# Altium schematic sheet 14-multimodal-microcontroller-switches-display.SchDoc
size A; SheetNumber: 7; SheetTotal: 10
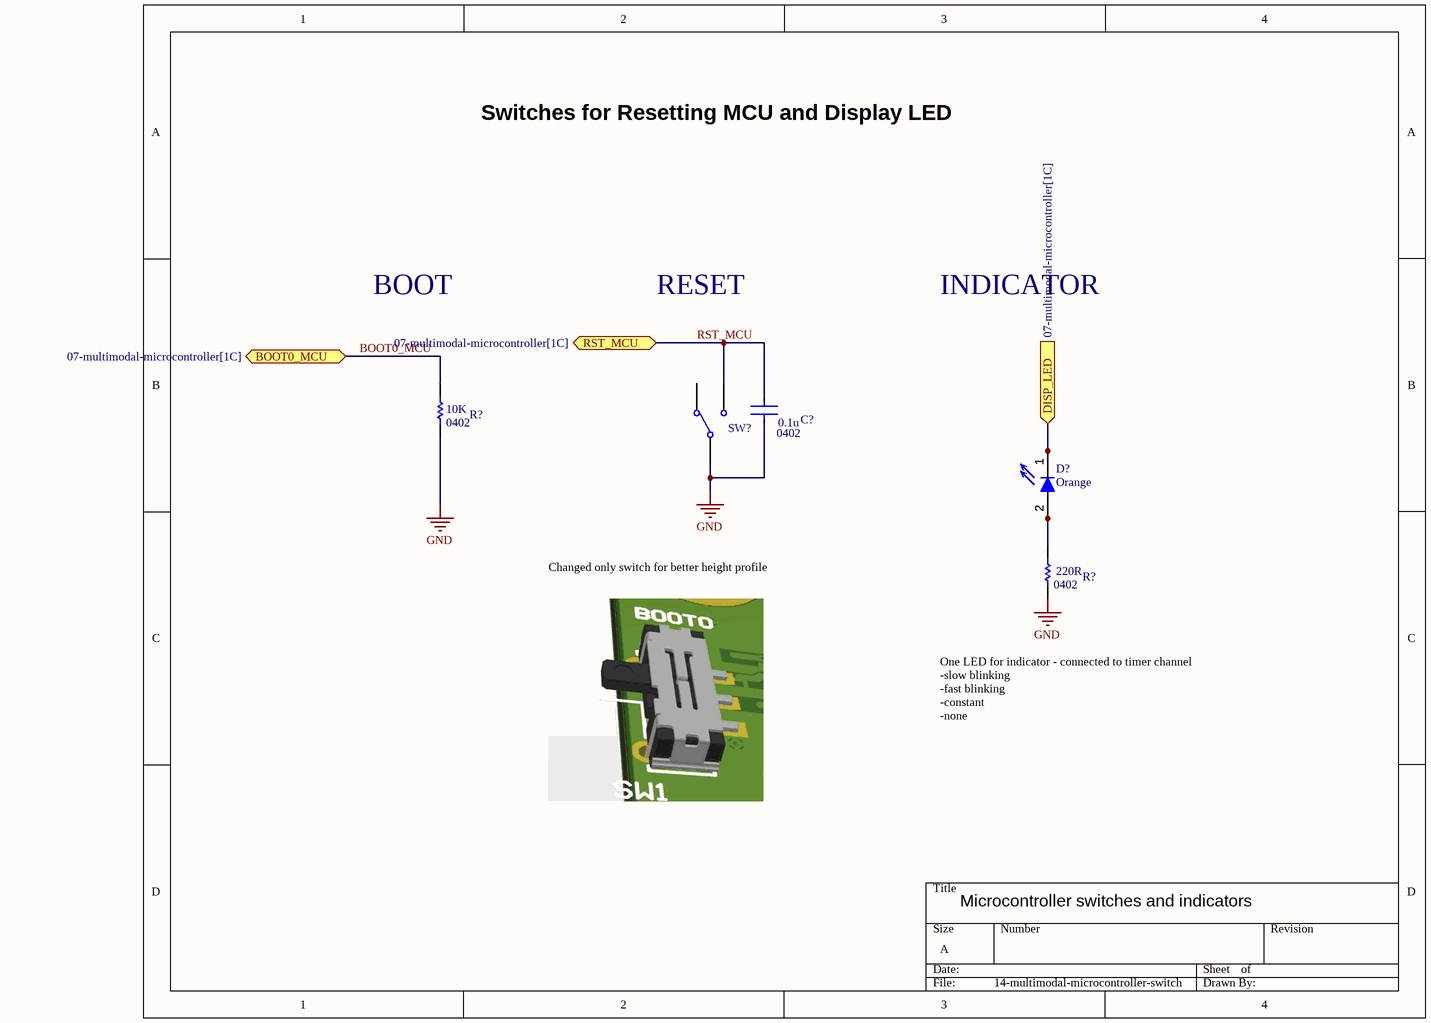
[diagram p0: 14-multimodal-microcontroller-switches-display.SchDoc]

## Parts
(Parts that share a designator on the sheet are numbered #1, #2 ... from top to bottom, then left to right.)
C?  C1005X7R1H104K050BB  [CAPTDK0402]  (value not drawn)
D?  Orange  [DISPLAY-LED]
R?#1  RMCF0402FT10K0  [RES-STACK-POLE-0402]  (value not drawn)
R?#2  RMCF0402JT220R  [RES-STACK-POLE-0402]  (value not drawn)
SW?  450405020524  [450405020524]  (value not drawn)

## Ports
BOOT0_MCU (bidir, see 07-multimodal-microcontroller[1C]), DISP_LED (in, see 07-multimodal-microcontroller[1C]), RST_MCU (bidir, see 07-multimodal-microcontroller[1C])

## Nets
GND: C?.2 R?#1.1 R?#2.1 SW?.COM
BOOT0_MCU: R?#1.2 ; port BOOT0_MCU
DISP_LED: D?.1 ; port DISP_LED
RST_MCU: C?.1 SW?.L2 ; port RST_MCU
NetD?_2: D?.2 R?#2.2

Not connected (* = marked no-connect by the designer): SW? L1

## Notes on the sheet
- Switches for Resetting MCU and Display LED
- BOOT
- RESET
- INDICATOR
- Changed only switch for better height profile
- One LED for indicator - connected to timer channel
  -slow blinking
  -fast blinking
  -constant
  -none
- Microcontroller switches and indicators
- (in symbol C1005X7R1H104K050BB) 0.1u; 0402
- (in symbol RMCF0402FT10K0) 10K; 0402
- (in symbol RMCF0402JT220R) 220R; 0402

## Library data of the parts
C? = C1005X7R1H104K050BB: CAP CER 0.1UF 50V X7R 0402; Supplier 1: Digi-Key; Supplier Part Number 1: 445-5932-1-ND
D? = LTST-C191KFKT: LED ORANGE CLEAR 0603 SMD; Supplier 1: Digi-Key; Supplier Part Number 1: 160-1445-1-ND
R?#1 = RMCF0402FT10K0: RES 10K OHM 1% 1/16W 0402; Supplier 1: Digi-Key; Supplier Part Number 1: RMCF0402FT10K0CT-ND
R?#2 = RMCF0402JT220R: RES 220 OHM 5% 1/16W 0402; Supplier 1: Digi-Key; Supplier Part Number 1: RMCF0402JT220RCT-ND
SW? = 450405020524: WS-SLSU SMT Mini Slide Switch Same Side Connection, SPDT, 5VDC, 300mA, 225g; Manufacturer: Wurth Elektronik; ComponentLink1Description: Website Link; ComponentLink1URL: https://www.we-online.com/redexpert/article/450405020524?ad; ComponentLink2Description: Datasheet Link; ComponentLink2URL: https://www.we-online.com/redexpert/spec/450405020524?ad; Manufacturer Part Number: 450405020524; Category: Slide Switches; Match Code: WS-SLSU; Mount: Surface Mount; Operating Temperature Max: 85°C; Operating Temperature Min: -40°C; Packaging: Tape and Reel; Length: 8.7mm; Width: 3mm; Height: 2mm; Circuit: SPDT; Contact Material: Copper Alloy; Contact Plating: Silver; Operation Force: 225g; Rated Current: 300mA; Rated Voltage: 5VDC; Terminal Material: Copper Alloy; Terminal Plating: Silver